# EAGLE schematic pstage (EAGLE 6.2)
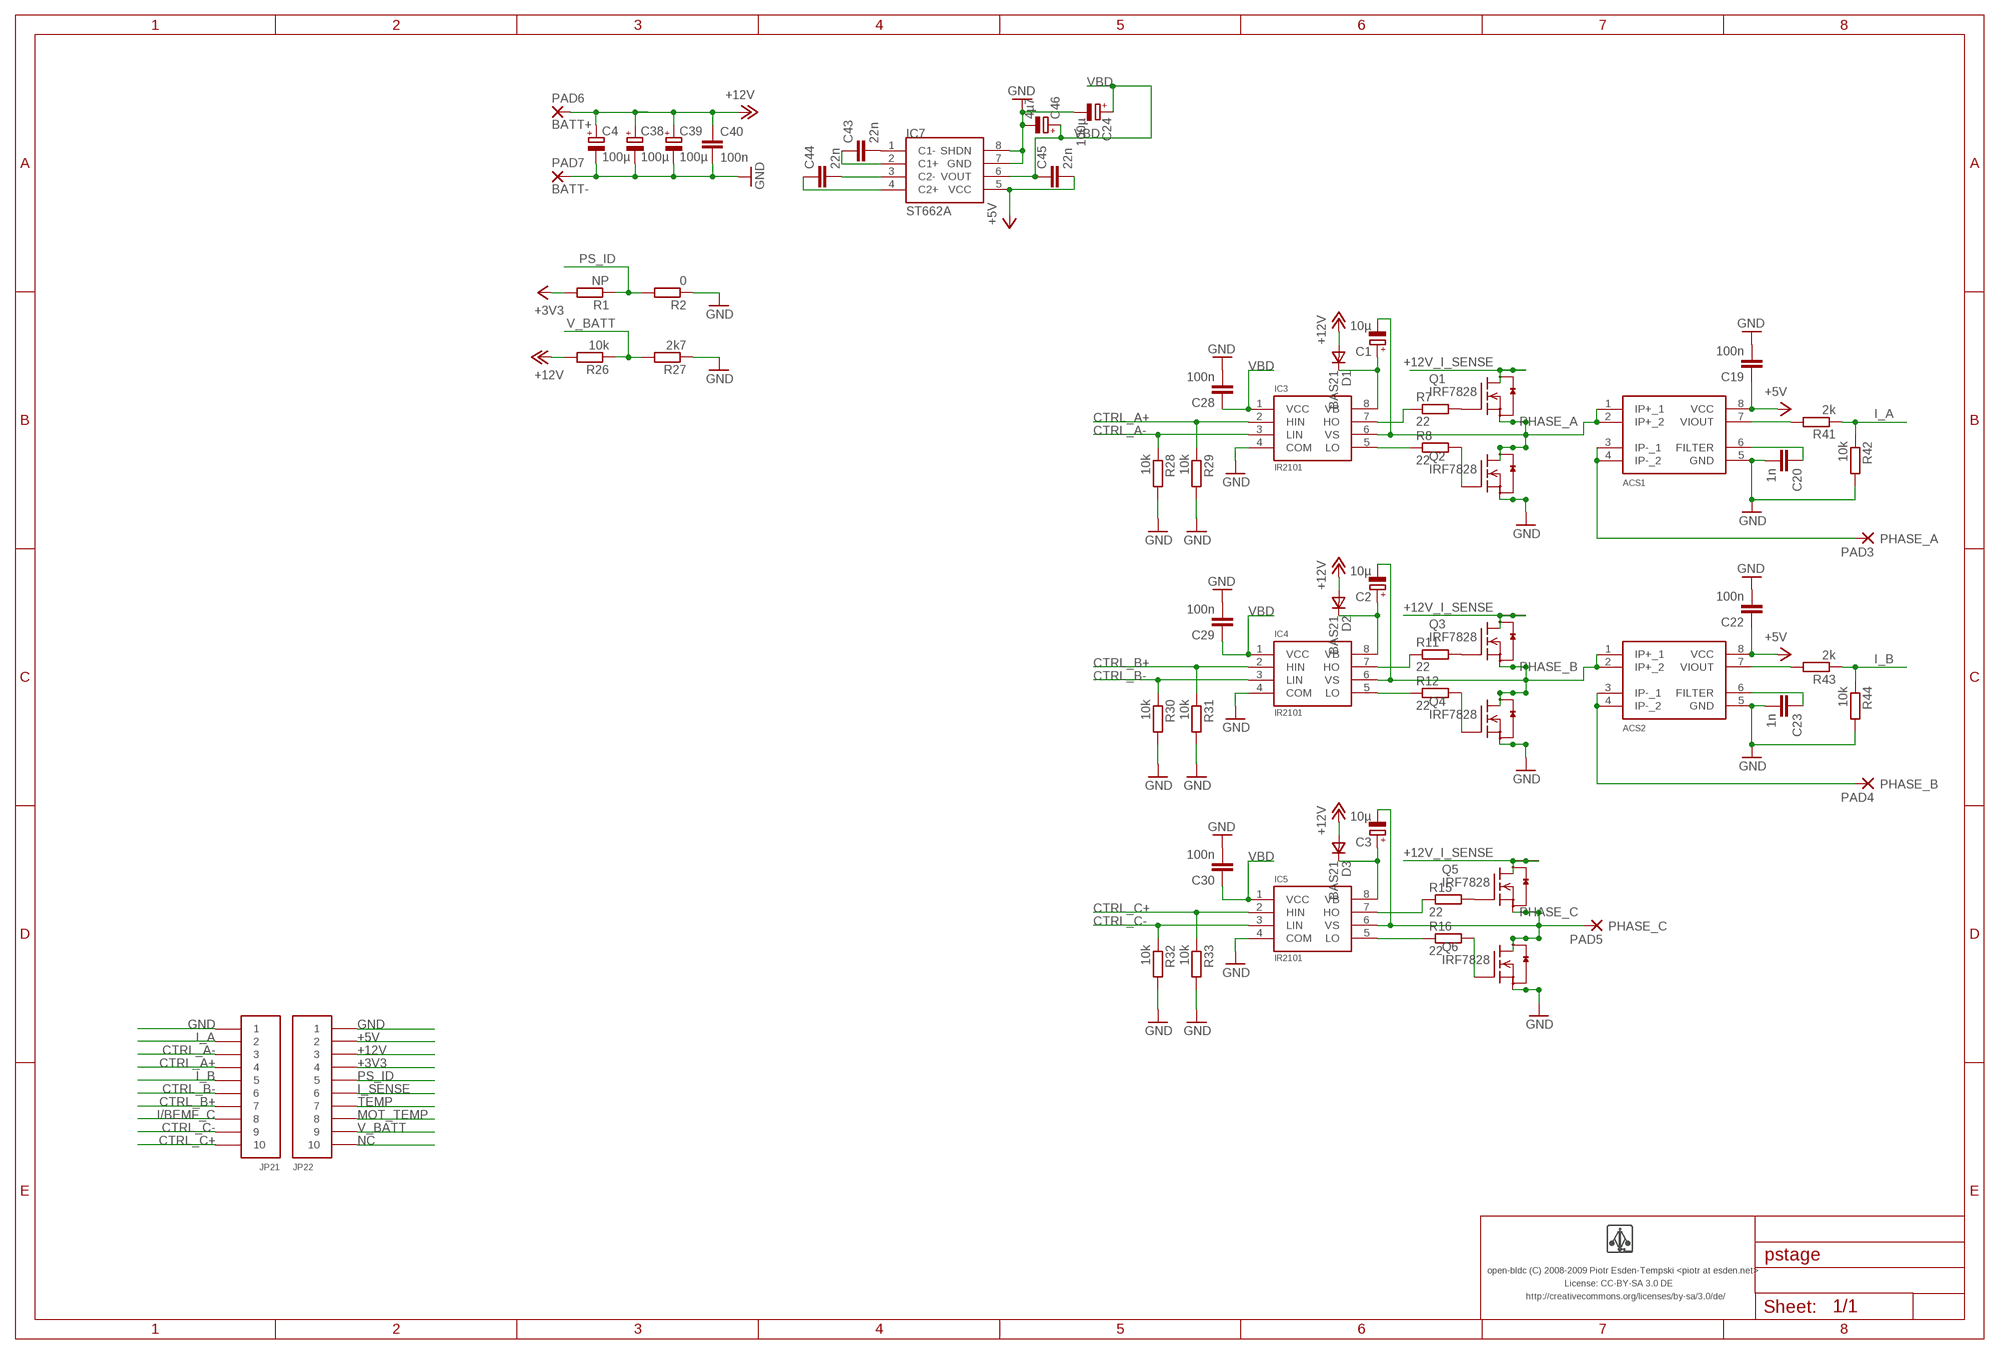
[diagram p0: schematic, sheet 1]

## Parts
ACS1  ACS712  [SO8]
ACS2  ACS712  [SO8]
C1  10µ  CPOL-EUA/3216-18R  [A/3216-18R]
C2  10µ  CPOL-EUA/3216-18R  [A/3216-18R]
C3  10µ  CPOL-EUA/3216-18R  [A/3216-18R]
C4  100µ  CPOL-EUD/7343-31R  [D/7343-31R]
C19  100n  C-EUC0603  [C0603]
C20  1n  C-EUC0603  [C0603]
C22  100n  C-EUC0603  [C0603]
C23  1n  C-EUC0603  [C0603]
C24  100µ  CPOL-EUD/7343-31R  [D/7343-31R]
C28  100n  C-EUC0603  [C0603]
C29  100n  C-EUC0603  [C0603]
C30  100n  C-EUC0603  [C0603]
C38  100µ  CPOL-EUD/7343-31R  [D/7343-31R]
C39  100µ  CPOL-EUD/7343-31R  [D/7343-31R]
C40  100n  C-EUC0603  [C0603]
C43  22n  C-EUC0603  [C0603]
C44  22n  C-EUC0603  [C0603]
C45  22n  C-EUC0603  [C0603]
C46  4µ7  CPOL-EUA/3216-18R  [A/3216-18R]
D1  BAS21  VAR2SOT23  [SOT-23]
D2  BAS21  VAR2SOT23  [SOT-23]
D3  BAS21  VAR2SOT23  [SOT-23]
IC3  IR2101  [SO-8]
IC4  IR2101  [SO-8]
IC5  IR2101  [SO-8]
IC7  ST662A  [SO8]
JP21  PIN_HDR_1.27MM_10  PIN_HDR_1.27MM_10_TH  [PIN_HDR_1.27MM_10]
JP22  PIN_HDR_1.27MM_10  PIN_HDR_1.27MM_10_TH  [PIN_HDR_1.27MM_10]
PAD3  PHASE_A  SMD5  [SMD2,54-5,08]
PAD4  PHASE_B  SMD5  [SMD2,54-5,08]
PAD5  PHASE_C  SMD5  [SMD2,54-5,08]
PAD6  BATT+  SMD5  [SMD2,54-5,08]
PAD7  BATT-  SMD5  [SMD2,54-5,08]
Q1  IRF7828  [SO8]
Q2  IRF7828  [SO8]
Q3  IRF7828  [SO8]
Q4  IRF7828  [SO8]
Q5  IRF7828  [SO8]
Q6  IRF7828  [SO8]
R1  NP  R-EU_R0603  [R0603]
R2  0  R-EU_R0603  [R0603]
R7  22  R-EU_R0603  [R0603]
R8  22  R-EU_R0603  [R0603]
R11  22  R-EU_R0603  [R0603]
R12  22  R-EU_R0603  [R0603]
R15  22  R-EU_R0603  [R0603]
R16  22  R-EU_R0603  [R0603]
R26  10k  R-EU_R0603  [R0603]
R27  2k7  R-EU_R0603  [R0603]
R28  10k  R-EU_R0603  [R0603]
R29  10k  R-EU_R0603  [R0603]
R30  10k  R-EU_R0603  [R0603]
R31  10k  R-EU_R0603  [R0603]
R32  10k  R-EU_R0603  [R0603]
R33  10k  R-EU_R0603  [R0603]
R41  2k  R-EU_R0603  [R0603]
R42  10k  R-EU_R0603  [R0603]
R43  2k  R-EU_R0603  [R0603]
R44  10k  R-EU_R0603  [R0603]
U$1  LOGO  [LOGO]

## Nets
+3V3: JP22.P$4 R1.2
+5V: ACS1.8(VCC) ACS2.8(VCC) C19.1 C22.1 C45.2 IC7.5(VCC) JP22.P$2
+12V: C4.+ C38.+ C39.+ C40.1 D1.3(A) D2.3(A) D3.3(A) JP22.P$3 PAD6.1(P) R26.2
+12V_I_SENSE: Q1.5(D1) Q1.6(D2) Q1.7(D3) Q1.8(D4) Q3.5(D1) Q3.6(D2) Q3.7(D3) Q3.8(D4) Q5.5(D1) Q5.6(D2) Q5.7(D3) Q5.8(D4)
CTRL_A+: IC3.2(HIN) JP21.P$4 R29.1
CTRL_A-: IC3.3(LIN) JP21.P$3 R28.1
CTRL_B+: IC4.2(HIN) JP21.P$7 R31.1
CTRL_B-: IC4.3(LIN) JP21.P$6 R30.1
CTRL_C+: IC5.2(HIN) JP21.P$10 R33.1
CTRL_C-: IC5.3(LIN) JP21.P$9 R32.1
GND: ACS1.5(GND) ACS2.5(GND) C4.- C19.2 C20.2 C22.2 C23.2 C24.- C28.2 C29.2 C30.2 C38.- C39.- C40.2 C46.- IC3.4(COM) IC4.4(COM) IC5.4(COM) IC7.7(GND) IC7.8(SHDN) JP21.P$1 JP22.P$1 PAD7.1(P) Q2.1(S3) Q2.2(S2) Q2.3(S1) Q4.1(S3) Q4.2(S2) Q4.3(S1) Q6.1(S3) Q6.2(S2) Q6.3(S1) R2.1 R27.1 R28.2 R29.2 R30.2 R31.2 R32.2 R33.2 R42.2 R44.2
I/BEMF_C: JP21.P$8
I_A: JP21.P$2 R41.1 R42.1
I_B: JP21.P$5 R43.1 R44.1
I_PHASE_A: ACS1.3(IP-_1) ACS1.4(IP-_2) PAD3.1(P)
I_PHASE_B: ACS2.3(IP-_1) ACS2.4(IP-_2) PAD4.1(P)
I_SENSE: JP22.P$6
MOT_TEMP: JP22.P$8
N$1: IC4.7(HO) R11.1
N$2: IC3.7(HO) R7.1
N$7: IC3.5(LO) R8.1
N$11: Q1.4(G) R7.2
N$12: C1.+ D1.1(C) IC3.8(VB)
N$13: IC4.5(LO) R12.1
N$14: Q5.4(G) R15.2
N$15: Q3.4(G) R11.2
N$16: C2.+ D2.1(C) IC4.8(VB)
N$17: Q4.4(G) R12.2
N$18: IC5.7(HO) R15.1
N$19: IC5.5(LO) R16.1
N$21: C3.+ D3.1(C) IC5.8(VB)
N$24: C43.2 IC7.1(C1-)
N$27: C44.2 IC7.3(C2-)
N$28: Q6.4(G) R16.2
N$29: C43.1 IC7.2(C1+)
N$30: C44.1 IC7.4(C2+)
N$31: ACS1.6(FILTER) C20.1
N$32: ACS1.7(VIOUT) R41.2
N$34: ACS2.6(FILTER) C23.1
N$35: ACS2.7(VIOUT) R43.2
N$43: Q2.4(G) R8.2
NC: JP22.P$10
PHASE_A: ACS1.1(IP+_1) ACS1.2(IP+_2) C1.- IC3.6(VS) Q1.1(S3) Q1.2(S2) Q1.3(S1) Q2.5(D1) Q2.6(D2) Q2.7(D3) Q2.8(D4)
PHASE_B: ACS2.1(IP+_1) ACS2.2(IP+_2) C2.- IC4.6(VS) Q3.1(S3) Q3.2(S2) Q3.3(S1) Q4.5(D1) Q4.6(D2) Q4.7(D3) Q4.8(D4)
PHASE_C: C3.- IC5.6(VS) PAD5.1(P) Q5.1(S3) Q5.2(S2) Q5.3(S1) Q6.5(D1) Q6.6(D2) Q6.7(D3) Q6.8(D4)
PS_ID: JP22.P$5 R1.1 R2.2
TEMP: JP22.P$7
V_BATT: JP22.P$9 R26.1 R27.2
VBD: C24.+ C28.1 C29.1 C30.1 C45.1 C46.+ IC3.1(VCC) IC4.1(VCC) IC5.1(VCC) IC7.6(VOUT)

## Notes on the sheet
- open-bldc (C) 2008-2009 Piotr Esden-Tempski <piotr at esden.net>
- License: CC-BY-SA 3.0 DE
- http://creativecommons.org/licenses/by-sa/3.0/de/

## Library data of the parts
ACS1 ACS2 = open-bldc:ACS712
C1-C4 C24 C38 C39 C46 = rcl:CPOL-EU: POLARIZED CAPACITOR, European symbol
C19 C20 C22 C23 C28-C30 C40 C43-C45 = rcl:C-EU: CAPACITOR, European symbol
D1-D3 = zetex:VAR2SOT23: DIODE
IC3-IC5 = open-bldc:IR2101
IC7 = open-bldc:ST662A
JP21 JP22 = open-bldc:PIN_HDR_1.27MM_10
PAD3-PAD7 = wirepad:SMD5: SMD PAD
Q1-Q6 = open-bldc:IRF7828
R1 R2 R7 R8 R11 R12 R15 R16 R26-R33 R41-R44 = rcl:R-EU_: RESISTOR, European symbol
U$1 = open-bldc:LOGO